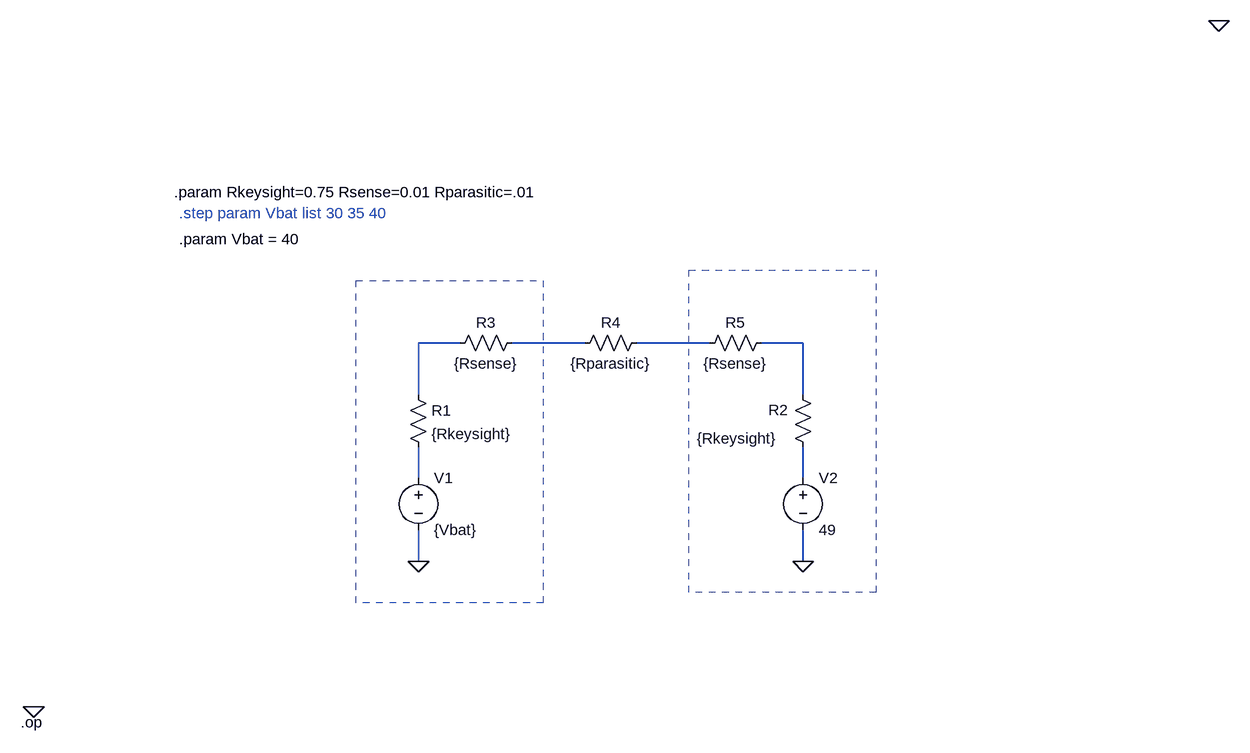
[diagram p0: schematic Battery ChargeDischarge.asc]
Battery ChargeDischarge.asc, the LTspice schematic file:
Version 4
SHEET 1 1268 680
WIRE 80 -80 16 -80
WIRE 272 -80 160 -80
WIRE 464 -80 352 -80
WIRE 608 -80 544 -80
WIRE 16 0 16 -80
WIRE 608 0 608 -80
WIRE 16 128 16 80
WIRE 608 128 608 80
WIRE 16 256 16 208
WIRE 608 256 608 208
FLAG -576 480 0
FLAG 1248 -576 0
FLAG 608 256 0
FLAG 16 256 0
DATAFLAG -176 -80 "I(R3)"
SYMBOL voltage 16 112 R0
WINDOW 123 0 0 Left 0
WINDOW 39 0 0 Left 0
SYMATTR InstName V1
SYMATTR Value {Vbat}
SYMBOL res 0 -16 R0
SYMATTR InstName R1
SYMATTR Value {Rkeysight}
SYMBOL res 592 -16 R0
WINDOW 0 -37 39 Left 2
WINDOW 3 -147 83 Left 2
SYMATTR InstName R2
SYMATTR Value {Rkeysight}
SYMBOL voltage 608 112 R0
WINDOW 123 0 0 Left 0
WINDOW 39 0 0 Left 0
SYMATTR InstName V2
SYMATTR Value 49
SYMBOL res 176 -96 R90
WINDOW 0 0 56 VBottom 2
WINDOW 3 32 56 VTop 2
SYMATTR InstName R3
SYMATTR Value {Rsense}
SYMBOL res 368 -96 R90
WINDOW 0 0 56 VBottom 2
WINDOW 3 32 56 VTop 2
SYMATTR InstName R4
SYMATTR Value {Rparasitic}
SYMBOL res 560 -96 R90
WINDOW 0 0 56 VBottom 2
WINDOW 3 32 56 VTop 2
SYMATTR InstName R5
SYMATTR Value {Rsense}
TEXT -360 -312 Left 2 !.param Rkeysight=0.75 Rsense=0.01 Rparasitic=.01
TEXT -596 504 Left 2 !.op
TEXT -352 -280 Left 2 ;.step param Vbat list 30 35 40
TEXT -352 -240 Left 2 !.param Vbat = 40
RECTANGLE Normal 208 320 -80 -176 2
RECTANGLE Normal 720 304 432 -192 2

The netlist it stands for:
* Battery ChargeDischarge.asc
V1 N005 0 {Vbat}
R1 N001 N005 {Rkeysight}
R2 N004 N006 {Rkeysight}
V2 N006 0 49
R3 N002 N001 {Rsense}
R4 N003 N002 {Rparasitic}
R5 N004 N003 {Rsense}
.param Rkeysight=0.75 Rsense=0.01 Rparasitic=.01
.op
* .step param Vbat list 30 35 40
.param Vbat = 40
.backanno
.end